# EAGLE design UPDIProgrammerStick (EAGLE 7.6.0)
COMPANY: ADAFRUIT INDUSTRIES; DRAWN: KTOWN; REV: H

## Sheet 1 of 2
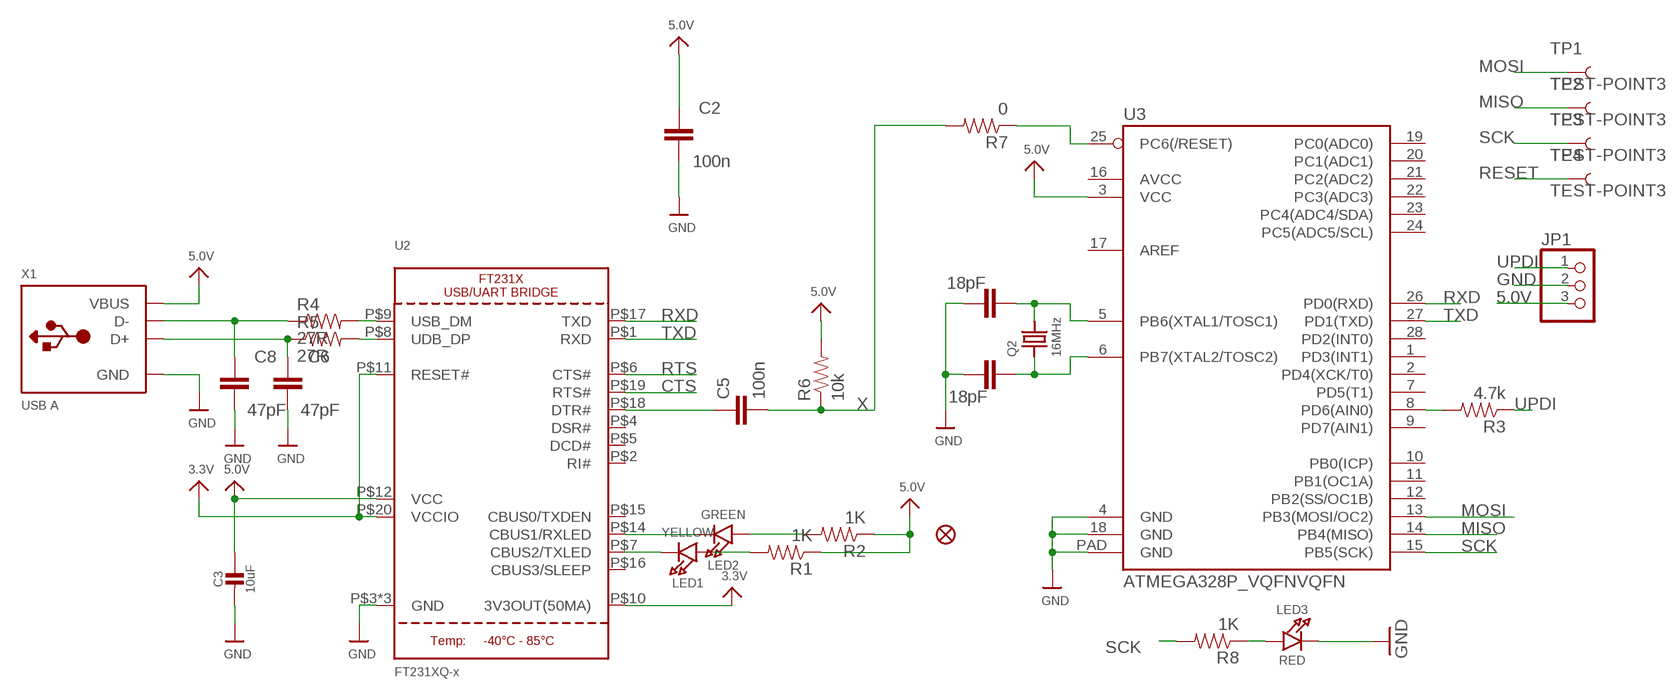
[diagram p0: schematic, sheet 1]

### Parts
C2  100n  CAP0603-CAP  [0603-CAP]
C3  10uF  CAP_CERAMIC_0805MP  [_0805MP]
C5  100n  CAP0603-CAP  [0603-CAP]
C6  47pF  CAP0603-CAP  [0603-CAP]
C8  47pF  CAP0603-CAP  [0603-CAP]
C12  18pF  CAP0603-CAP  [0603-CAP]
C13  18pF  CAP0603-CAP  [0603-CAP]
FID2  FIDUCIAL""  [FIDUCIAL_1MM]
JP1  PINHD-1X3  [1X03]
LED1  YELLOW  LED0805_NOOUTLINE  [CHIPLED_0805_NOOUTLINE]
LED2  GREEN  LED0805_NOOUTLINE  [CHIPLED_0805_NOOUTLINE]
LED3  RED  LED0805_NOOUTLINE  [CHIPLED_0805_NOOUTLINE]
Q2  16MHz  CRYSTALTHIN  [CRYSTAL_3.2X2.5]
R1  1K  0.3OHM-1/8W-1%(0805)  [0805]
R2  1K  0.3OHM-1/8W-1%(0805)  [0805]
R3  4.7k  0.3OHM-1/8W-1%(0805)  [0805]
R4  27R  0.3OHM-1/8W-1%(0805)  [0805]
R5  27R  0.3OHM-1/8W-1%(0805)  [0805]
R6  10k  0.3OHM-1/8W-1%(0805)  [0805]
R7  0  0.3OHM-1/8W-1%(0805)  [0805]
R8  1K  0.3OHM-1/8W-1%(0805)  [0805]
TP1  TEST-POINT3  [PAD.03X.03]
TP2  TEST-POINT3  [PAD.03X.03]
TP3  TEST-POINT3  [PAD.03X.03]
TP4  TEST-POINT3  [PAD.03X.03]
U2  FT231XQ-x  FT231X  [QFN20_4MM]
U3  ATMEGA328P_VQFNVQFN  [VQFN-28]
X1  USB A  USB_TYPEA_CLIENTTHM  [USB_A-THM]

### Nets
3.3V: U2.P$10(3V3OUT(50MA)) U2.P$11(RESET#) U2.P$20(VCCIO)
5.0V: C2.1 C3.1 JP1.3 R1.1 R2.1 R6.2 U2.P$12(VCC) U3.3(VCC) X1.VBUS
CTS: U2.P$19(RTS#)
GND: C2.2 C3.2 C6.2 C8.2 C12.2 C13.2 JP1.2 LED3.C U2.P$3(GND) U2.P$13(GND) U2.P$21(GND) U3.4(GND) U3.18(GND) U3.PAD(GND) X1.GND
MISO: TP2.P$1 U3.14(PB4(MISO))
MOSI: TP1.P$1 U3.13(PB3(MOSI/OC2))
N$1: LED2.A R2.2
N$3: R3.2 U3.8(PD6(AIN0))
N$4: LED1.A R1.2
N$5: LED1.C U2.P$7(CBUS2/TXLED)
N$6: LED2.C U2.P$14(CBUS1/RXLED)
N$8: C8.1 R4.1 X1.D-
N$9: C6.1 R5.1 X1.D+
N$10: C12.1 Q2.2 U3.5(PB6(XTAL1/TOSC1))
N$11: C13.1 Q2.1 U3.6(PB7(XTAL2/TOSC2))
N$15: R5.2 U2.P$8(UDB_DP)
N$16: LED3.A R8.1
N$24: R4.2 U2.P$9(USB_DM)
N$27: C5.1 U2.P$18(DTR#)
RESET: R7.1 TP4.P$1 U3.25(PC6(/RESET))
RTS: U2.P$6(CTS#)
RXD: U2.P$17(TXD) U3.26(PD0(RXD))
SCK: R8.2 TP3.P$1 U3.15(PB5(SCK))
TXD: U2.P$1(RXD) U3.27(PD1(TXD))
UPDI: JP1.1 R3.1
X: C5.2 R6.1 R7.2
Unconnected: U2.P$2(RI#) U2.P$4(DSR#) U2.P$5(DCD#) U2.P$15(CBUS0/TXDEN) U2.P$16(CBUS3/SLEEP) U3.1(PD3(INT1)) U3.2(PD4(XCK/T0)) U3.7(PD5(T1)) U3.9(PD7(AIN1)) U3.10(PB0(ICP)) U3.11(PB1(OC1A)) U3.12(PB2(SS/OC1B)) U3.16(AVCC) U3.17(AREF) U3.19(PC0(ADC0)) U3.20(PC1(ADC1)) U3.21(PC2(ADC2)) U3.22(PC3(ADC3)) U3.23(PC4(ADC4/SDA)) U3.24(PC5(ADC5/SCL)) U3.28(PD2(INT0))

## Sheet 2 of 2

## Library data of the parts
C2 C5 C6 C8 C12 C13 = SparkFun-Capacitors:CAP: Capacitor Standard 0603 ceramic capacitor, and 0.1" leaded capacitor.
C3 = microbuilder:CAP_CERAMIC: Ceramic Capacitors For new designs, use the packages preceded by an '_' character since they are more reliable: The following footprints should be used on most boards: _0402 - Standard footprint for regular board layouts _0603 - Standard footprint for regular board layouts _0805 - Standard footprint for regular board layouts _1206 - Standard footprint for regular board layouts For extremely tight-pitch boards where space is at a premium, the following 'micro-pitch' footprints can be used (smaller pads, no silkscreen outline, etc.): _0402MP - Micro-pitch footprint for very dense/compact boards _0603MP - Micro-pitch footprint for very dense/compact boards _0805MP - Micro-pitch footprint for very dense/compact boards _1206MP - Micro-pitch footprint for very dense/compact boards
FID2 = microbuilder:FIDUCIAL: Fiducial Alignment Points Various fiducial points for machine vision alignment.; BOM: EXCLUDE
JP1 = adafruit:PINHD-1X3: PIN HEADER
LED1-LED3 = microbuilder:LED: LED 0603 - 0603 Surface Mount Package 2mA: Green LED - Low Power (3.9mcd, 2ma, 1.7Vf) - Digikey: 475-2709-2-ND Orange LED - Low Power (9.8mcd, 2ma, 1.8Vf) - Digikey: 475-1194-2-ND Red LED - Low Power (5mcd, 2ma, 1.8Vf) - Digikey: 475-1195-2-ND Yellow LED - Low Power (7mcd, 2ma, 1.8Vf) - Digikey: 475-1196-2-ND 5mA: Blue LED - Low Power (17mcd, 5ma, 2.9Vf) - Digikey: LNJ937W8CRACT-ND 0805 - 0805 Surface Mount Package 2mA: Red LED (8.8mcd, 2mA, 1.8Vf, Clear) - Low Power [Digikey: 475-2510-1-ND] Green LED (5mcd, 2mA, 1.8Vf, Clear) - Low Power [Digikey: 475-2730-1-ND] Yellow LED (11.3mcd, 2mA, 1.8Vf, Clear) - Low Power [Digikey: 475-2555-1-ND] 20mA: Red LED (104mcd, 20mA, Diffused) - LS R976 [Digikey: 475-1278-6-ND] Red LED (12mcd, 20mA, 2.0Vf, Clear) - APT2012EC [Digikey: 754-1128-1-ND] Green LED (15mcd, 20mA, 2.2Vf, Clear) - APT2012GC [Digikey: 754-1131-1-ND] Orange LED (160mcd, 20mA, 2.1Vf, Clear) - APT2012SECK [Digikey: 754-1130-1-ND] 1206 - 1206 Surface Mount Package Green LED (26mcd, 20mA, Diffused) - LG N971 [Digikey: 475-1407-6-ND] Red LED (15mcd, 20mA, Diffused) - LH N974 [Digikey: 475-1416-6-ND] Cree - Cree High-Power Surface Mount LEDs XPEBWT-L1-0000-00D50 - White 111lm 350mA 2.9Vf 6200K 110° XTEAWT-00-0000-00000LEE3 - White 114lm 350mA 2.85Vf 5000K 115° Everlight - Everlight 45-21 Series Surface Mount LEDs 45-21/QK2C-B2832AC2CB2/2T - Warm White 2000mcd 20mA 3.25Vf 3050K 120° 45-21/LK2C-B38452C4CB2/2T - Nuetral White 2000mcd 20mA 3.25Vf 4150K 120° 45-21/LK2C-B50634C6CB2/2T - Cold White 2200mcd 20mA 3.25Vf 5650K 120° PLCC2 Reverse Mount LS T77K-J1L2-1-0-2-R18-Z - Red 11.25mcd 2mA 1.8Vf 630nm 120° LO T77K-L1M2-24-Z - Orange 19.6mcd 2mA 1.8Vf 606nm 120° LY T77K-K2M1-26-Z - Yellow 15.7mcd 2mA 1.8Vf 587nm 120°
Q2 = microbuilder:CRYSTAL: Crystals HC49UP - Surface Mount Crystal 4.0MHz 18pF +/-30ppm Surface Mount Crystal [Digikey: 535-9857-1-ND] 12.0 MHz Surface Mount Crystal [Digikey: 535-9869-6-ND] 25.0 MHz Surface Mount Crystal [Digikey: 535-9078-1-ND] 2.5 x 2.0mm - MEMs SMT Crystal 16.0 MHz 10pF 20ppm 2.5 x 2.0mm Crystal [Digikey -40-85°C: 535-10923-1-ND] 3.2 x 2.5mm - MEMs SMT Crystal 12.0 MHz 8pF 15ppm 3.2 x 2.5mm Crystal [Digikey: -10-70°C: 644-1047-1-ND -40-125°C: 644-1128-1-ND] 16.0 MHz 8pF 15ppm 3.2 x 2.5mm Crystal [Digikey: -10-70°C: 644-1049-1-ND -40-125°C: 644-1129-2-ND] 16.0 MHz 10pF 10ppm 3.2 x 2.5mm Crystal [Digikey: 644-1100-1-ND] 27.12 MHz 18pF 30ppm 3.2 x 2.5mm Crystal [Digikey: 887-1424-1-ND] 27.12MHz 10pF 10ppm 3.2 x 2.5mm Crystal [Digikey: 887-1329-1-ND] 4.9 x 1.8mm - MEMs SMT Crystal 32.768 KHz 12.5pF 20ppm 4.9 x 1.8mm Crystal [Digikey: SE2415CT-ND] 8.0 x 3.8mm - Surface Mount Crystal 32.768kHz 12.5pF 20ppm -40°C-85°C [Digikey: 535-9166-2-ND] Cylinder 32.768KHz Cylinder Crystal (2x6mm body) [Ex. Digikey: 300-8341-2-ND]
R1-R8 = SparkFun-Resistors:0.3OHM-1/8W-1%(0805): RES-11622; PROD_ID: RES-11622; VALUE: 0.3
TP1-TP4 = SparkFun-Passives:TEST-POINT: Bare copper test points for troubleshooting or ICT
U2 = microbuilder:FT231X: FT231X USB To Full Handshake UART IC
U3 = SparkFun-DigitalIC:ATMEGA328P_VQFN
X1 = microbuilder:USB_TYPEA: USB - Type A Connectors Male types stick out and are inserted into a PC or matching females parts (these are the connectors used on USB Memory Sticks, etc.). Female parts are generally used for USB Host and accept a male-type connector. SMT - 4UCON: 10017 PTHFML - Digikey: 609-1045-ND, 4UCon: 05241 PCB - Use 2.0mm thick PCBs with this footprint

## Board
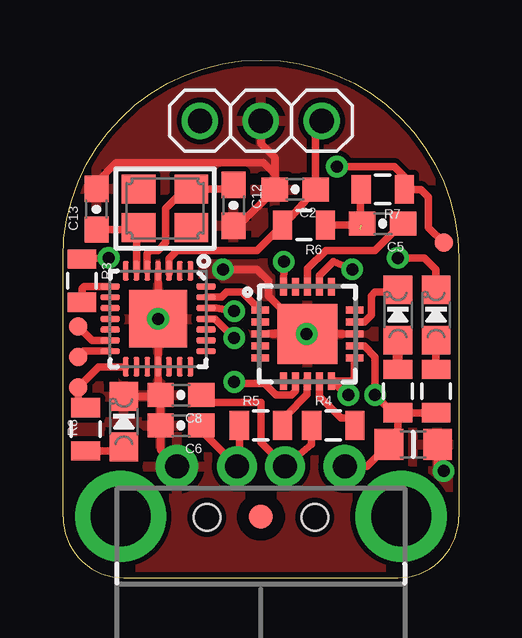
[diagram p1: board, top side]
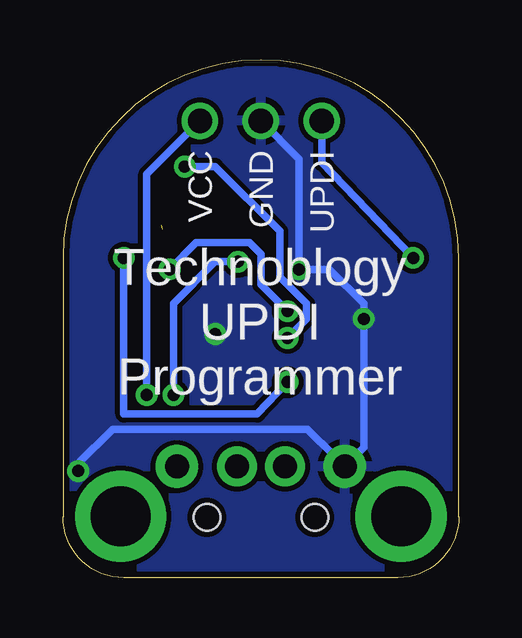
[diagram p2: board, bottom side, seen from below]

Size 16.51 x 21.59 mm. Coordinates in mm from the lower left corner, seen from the top.
Outline: 0,2.54 arc90 2.54,0 13.97,0 arc90 16.51,2.54 16.51,13.34 arc180 0,13.34 0,2.54
Copper layers (1*16): Top 0.035mm / dielectric 1.5mm / Bottom 0.035mm
Design rules "adafruit": minimum track width 8mil, minimum drill 15.5mil, track to track 8mil, track to pad 8mil, pad to pad 8mil, via to via 8mil, smd to smd 8mil, copper to edge 10mil, drill to drill 8mil, minimum pad ring 10mil, minimum via ring 8mil, stop-mask expansion 2mil, vias tented up to drill 20mil, thermal gap 10mil

### Footprints (pad centres in the part's own frame; a part is rotated, then mirrored left to right if it is on the bottom)
0603-CAP = smd 1.1 x 1: 1 -0.85,0; 2 0.85,0
_0805MP = smd 1.2 x 1.3: 1 -1.016,0; 2 1.016,0
FIDUCIAL_1MM = smd 1 x 1: 1 0,0
1X03 = drill 1.016: 1 -2.54,0; 2 0,0; 3 2.54,0
CHIPLED_0805_NOOUTLINE = smd 1.2 x 1.2: A 0,-1.05; C 0,1.05
CRYSTAL_3.2X2.5 = smd 1.4 x 1.2: 1 -1.1,-0.8; 2 1.1,0.8; GND1 -1.1,0.8; GND2 1.1,-0.8
0805 = smd 0.8 x 1.2: 1 -0.9,0; 2 0.9,0
PAD.03X.03 = smd 0.762 x 0.762: P$1 0,0
QFN20_4MM = smd 0.73 x 0.28: P$1 -1.965,1; P$2 -1.965,0.5; P$3 -1.965,0; P$4 -1.965,-0.5; P$5 -1.965,-1; P$11 1.965,-1; P$12 1.965,-0.5; P$13 1.965,0; P$14 1.965,0.5; P$15 1.965,1 | smd 0.28 x 0.73: P$6 -1,-1.965; P$7 -0.5,-1.965; P$8 0,-1.965; P$9 0.5,-1.965; P$10 1,-1.965; P$16 1,1.965; P$17 0.5,1.965; P$18 0,1.965; P$19 -0.5,1.965; P$20 -1,1.965 | smd 2.5 x 2.5: P$21 0,0
VQFN-28 = smd 0.82 x 0.24: 1 -2,1.35; 2 -2,0.9; 3 -2,0.45; 4 -2,0; 5 -2,-0.45; 6 -2,-0.9; 7 -2,-1.35; 15 2,-1.35; 16 2,-0.9; 17 2,-0.45; 18 2,0; 19 2,0.45; 20 2,0.9; 21 2,1.35 | smd 0.24 x 0.82: 8 -1.35,-2; 9 -0.9,-2; 10 -0.45,-2; 11 0,-2; 12 0.45,-2; 13 0.9,-2; 14 1.35,-2; 22 1.35,2; 23 0.9,2; 24 0.45,2; 25 0,2; 26 -0.45,2; 27 -0.9,2; 28 -1.35,2 | smd 2.4 x 2.4: PAD 0,0
USB_A-THM = drill 1 pad 1.676: D+ 1,-2.1; D- -1,-2.1 | drill 1 pad 1.778: GND 3.5,-2.1; VBUS -3.5,-2.1 | drill 2.5 pad 3.81: MNT1 -5.85,-0.02; MNT2 5.85,-0.02 | hole 1.1: -2.25,0.022; 2.25,0.022

### Placement (x,y rotation side)
C2  9.68,16.19 180 top
C3  14.61,5.56 0 top
C5  13.34,14.76 180 top
C6  4.92,6.35 180 top
C8  4.92,7.62 180 top
C12  7.11,15.53 270 top
C13  1.4,15.37 90 top
FID2  8.26,2.54 0 top
JP1  8.26,19.05 0 top
LED1  15.56,10.95 0 top
LED2  13.97,10.95 0 top
LED3  2.54,6.51 0 top
Q2  4.25,15.4 0 top
R1  15.56,7.78 90 top
R2  13.97,7.78 90 top
R3  0.79,12.38 270 top
R4  11.27,6.35 0 top
R5  8.26,6.35 0 top
R6  10.05,14.71 180 top
R7  13.34,16.19 180 top
R8  0.95,6.19 90 top
TP1  0.64,10.48 0 top
TP2  0.64,9.21 0 top
TP3  0.64,7.94 0 top
TP4  15.88,13.97 0 top
U2  10.19,10.16 0 top
U3  3.97,10.79 270 top
X1  8.26,2.54 180 top

### Tracks (layer width: path | path; a pad name or v marks a point on that pad's centre or on a via)
3.3V  (via drill 0.5)
  Top 0.305: v11.91,7.62 11.86,7.62 U2.P$10 12.16,8.2 U2.P$11 | v9.21,13.18 9.19,12.06 U2.P$20
  Bottom 0.305: v9.21,13.18 10.16,13.18 11.91,11.43 v11.91,7.62
5.0V  (via drill 0.5)
  Top 0.305: R2.1 R1.1 | X1.VBUS 12.67,4.64 C3.1 13.97,5.94 R2.1 | 4.42,12.67 U3.3 4.42,13.31 4.76,13.65 8.1,13.65 R6.2 9.15,14.65 C2.1 | U2.P$12 12.56,9.66 13.02,9.21 v13.02,7.62 13.76,6.88 R2.1 | 10.79,16.45 C2.1 | C2.1 10.53,18.79 JP1.3
  Bottom 0.305: v13.02,7.62 13.02,16.83 JP1.3
AD0  (1 unrouted)
GND  (via drill 0.5)
  Top 0.305: 8.83,16.83 C2.2 7.32,14.68 C12.2 | 8.83,16.83 8.83,17.52 8.26,18.1 JP1.2 | X1.GND 4.07,5.32 C6.2 C8.2 | C8.2 3.97,7.72 U3.18 U3.PAD U3.4 | C13.2 1.4,16.48 2.22,17.3 8.36,17.3 8.83,16.83 | LED3.C 4.01,7.56 C8.2 | U2.P$13 U2.P$21 v10.16,10.16 U2.P$3 9.43,10.26 9.53,10.16 9.53,10.95 9.37,10.95 8.57,11.75 8.57,12.38 8.1,12.86 v6.67,12.86 | C3.2 15.62,4.7 v15.88,4.45
  Bottom 0.305: v15.88,4.45 15.88,4.76 14.45,6.19 6.31,6.19 5.2,5.08 | 5.2,5.08 X1.GND | 5.2,5.08 4.45,5.08 4.38,5.01 3.97,5.43 U3.PAD 3.97,11.43 5.4,12.86 v6.67,12.86 6.67,17.46 JP1.2
  other vias: 3.97,10.79
  pour Bottom: -0.64,21.59 17.14,21.43 17.14,0 -0.64,0
  pour Top: -0.64,21.59 17.14,21.43 17.14,0 -0.64,0
MISO
  Top 0.305: U3.14 0.87,9.45 TP2.P$1
MOSI
  Top 0.305: U3.13 1.22,9.89 TP1.P$1
N$1
  Top 0.406: R2.2 LED2.A
N$3
  Top 0.305: U3.8 0.87,12.14 0.79,12.06 R3.2
N$4
  Top 0.305: LED1.A R1.2
N$5  (via drill 0.5)
  Top 0.305: v7.14,8.16 7.37,8.1 8.41,8.1 8.89,7.62 9.53,7.62 9.69,7.79 U2.P$7 | LED1.C 15.56,12.86 15.08,13.34 v13.97,13.34
  Bottom 0.305: v7.14,8.16 8.41,6.83 13.97,6.83 v13.97,13.34
N$6
  Top 0.305: LED2.C 13.87,11.91 13.02,11.91 12.86,11.75 12.86,10.95 12.56,10.66 U2.P$14
N$8
  Top 0.305: R4.1 10.37,5.55 X1.D- 8.26,5.64 8.26,7.3 6.35,7.3 C8.1
N$9
  Top 0.305: R5.1 7.36,4.74 X1.D+ 5.77,6.12 C6.1
N$10
  Top 0.305: C12.1 7.09,16.2 Q2.2 5.09,16.2 4.29,15.4 4.29,13.97 3.97,13.65 3.65,13.65 3.52,13.52 U3.5
N$11
  Top 0.305: C13.1 3.07,14.52 Q2.1 3.07,14.51 U3.6
N$15
  Top 0.305: R5.2 9.15,6.77 9.31,6.77 10.19,7.64 10.19,8.28 U2.P$8
N$16
  Top 0.305: R8.1 2.37,5.29 LED3.A
N$24
  Top 0.305: U2.P$9 10.69,7.56 11.59,6.67 11.85,6.67 R4.2
N$27
  Top 0.305: U2.P$18 10.19,12.88 10.96,13.65 13.02,13.65 13.97,14.61 C5.1
RESET  (via drill 0.5)
  Top 0.305: U3.25 6.35,10.79 v7.14,10 | TP4.P$1 15.24,14.61 15.24,15.88 14.92,16.19 R7.1 14.23,16.72 13.81,17.14 v11.43,17.14
  Bottom 0.305: v7.14,10 6.35,10.79 6.35,11.43 7.46,12.54 7.46,14.45 10.16,17.14 v11.43,17.14
RXD  (via drill 0.5)
  Top 0.305: U2.P$17 10.69,12.6 11.27,13.18 v12.06,12.86 | U3.26 6.38,11.24 v7.14,11.11
  Bottom 0.305: v7.14,11.11 8.26,12.22 8.26,13.49 8.73,13.97 10.95,13.97 v12.06,12.86
SCK
  Top 0.305: 0.79,7.25 R8.2 0.64,7.41 TP3.P$1 1.49,8.79 U3.15
TXD
  Top 0.305: U2.P$1 8.21,11.16 7.46,11.91 6.83,11.91 6.62,11.7 U3.27
UPDI  (via drill 0.5)
  Top 0.305: R3.1 v1.91,13.34
  Bottom 0.305: v1.91,13.34 5.71,17.3 JP1.1
X  (1 unrouted)
  Top 0.305: 12.38,14.55 R7.2 | R6.1 12.43,14.71 C5.2

### Text on the board
bPlace: UPDI | GND | VCC | Technoblogy / UPDI / Programmer
Document: Designed for USB-7201-C (Digikey 377-1735-ND)